# EAGLE design TempSensorMunny (EAGLE 5.04)
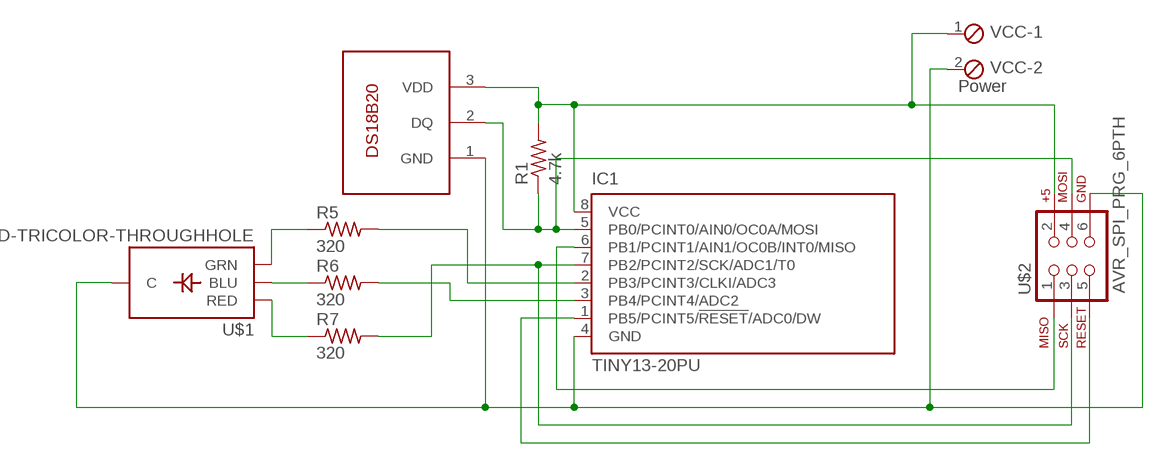
[diagram p0: schematic, sheet 1]

## Parts
IC1  TINY13-20PU  [DIL08]
R1  4.7k  R-US_0411/3V  [0411V]
R5  320  R-US_0411/3V  [0411V]
R6  320  R-US_0411/3V  [0411V]
R7  320  R-US_0411/3V  [0411V]
U$1  LED-TRICOLOR-THROUGHHOLE  [LED-TRICOLOR-THROUGHHOLE]
U$2  AVR_SPI_PRG_6PTH  [2X3]
U$3  DS18B20  [TO-92]
VCC  Power  MPT2  [2POL254]

## Nets
GND: IC1.4(GND) U$1.GND(C) U$2.6 U$3.1(GND) VCC.2
N$1: R5.1 U$1.GRN
N$2: R6.1 U$1.BLU
N$3: R7.1 U$1.RED
N$4: IC1.7(PB2/PCINT2/SCK/ADC1/T0) R7.2 U$2.3
N$5: IC1.3(PB4/PCINT4/ADC2) R6.2
N$6: IC1.2(PB3/PCINT3/CLKI/ADC3) R5.2
N$9: IC1.5(PB0/PCINT0/AIN0/OC0A/MOSI) R1.1 U$2.4 U$3.2(DQ)
N$10: IC1.6(PB1/PCINT1/AIN1/OC0B/INT0/MISO) U$2.1
N$11: IC1.1(PB5/PCINT5/!RESET!/ADC0/DW) U$2.5
VDD: IC1.8(VCC) R1.2 U$2.2 U$3.3(VDD) VCC.1

## Library data of the parts
IC1 = atmel:TINY13: 8-bit AVR Microcontroller with 1K Bytes In-System Programmable Flash Source: http://www.atmel.com/dyn/resources/prod_documents/2535S.pdf
R1 R5-R7 = resistor:R-US_: RESISTOR, American symbol
U$1 = SparkFun:LED-TRICOLOR-THROUGHHOLE
U$2 = SparkFun:AVR_SPI_PRG_6: AVR ISP 6 Pin This is the reduced ISP connector for AVR programming. Common on Arduino. This footprint will take up less PCB space and can be used with a 10-pin to 6-pin adapter such as SKU: BOB-08508
U$3 = nall:DS18B20: DS18B20 1-Wire digital temperature sensor from Maxim IC. Reports degrees C with 9 to 12-bit precision, -55C to 125C (+/-0.5C).
VCC = con-phoenix-254:MPT2: PHOENIX CONNECTOR

## Board
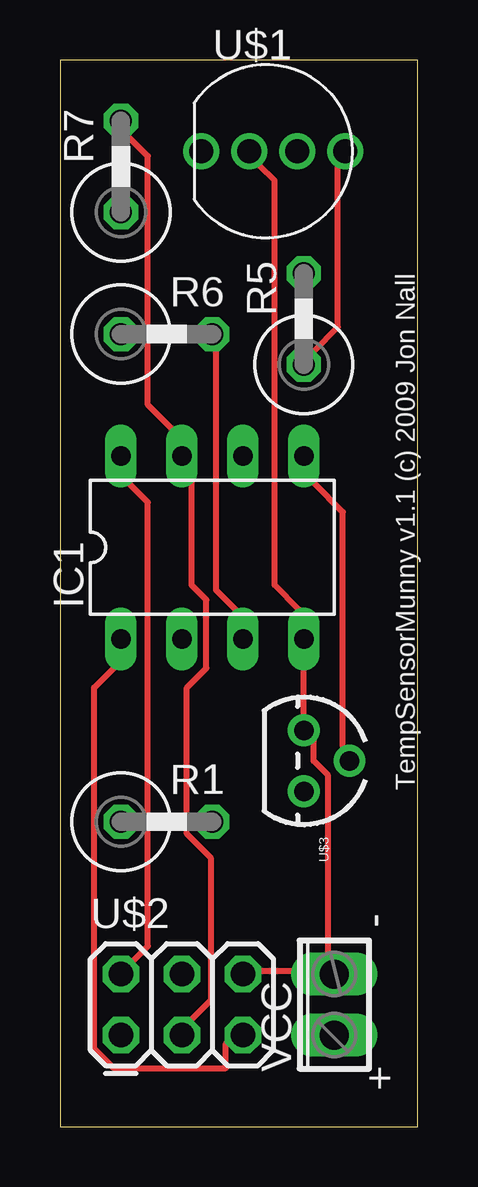
[diagram p1: board, top side]
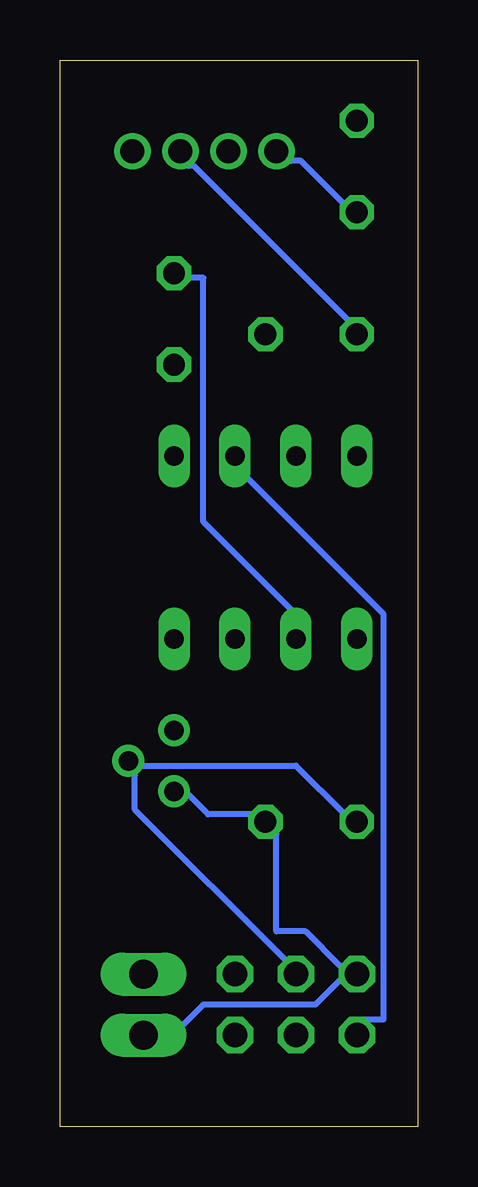
[diagram p2: board, bottom side, seen from below]

Size 14.91 x 44.44 mm. Coordinates in mm from the lower left corner, seen from the top.
Outline: 0,0 14.91,0 14.91,44.44 0,44.44 0,0
Copper layers (1*16): Top 0.035mm / dielectric 1.5mm / Bottom 0.035mm
Design rules "default": minimum track width 10mil, minimum drill 24mil, track to track 8mil, track to pad 8mil, pad to pad 8mil, via to via 8mil, smd to smd 8mil, copper to edge 40mil, drill to drill 8mil, minimum pad ring 10mil, minimum via ring 8mil, stop-mask expansion 4mil, vias tented up to drill 0mil, thermal gap 10mil

### Footprints (pad centres in the part's own frame; a part is rotated, then mirrored left to right if it is on the bottom)
DIL08 = drill 0.813 long: 1 -3.81,-3.81; 2 -1.27,-3.81; 3 1.27,-3.81; 4 3.81,-3.81; 5 3.81,3.81; 6 1.27,3.81; 7 -1.27,3.81; 8 -3.81,3.81
0411V = drill 0.914 octagon: 1 -2.54,0; 2 1.27,0
LED-TRICOLOR-THROUGHHOLE = drill 1 round: BLU 1,0; GND -1,0; GRN 3,0; RED -3,0
2X3 = drill 1.016 octagon: 1 0,0; 2 0,2.54; 3 2.54,0; 4 2.54,2.54; 5 5.08,0; 6 5.08,2.54
TO-92 = drill 0.813 round: 1 -1.27,0; 2 0,1.905; 3 1.27,0
2POL254 = drill 1.2 long: 1 -1.27,0; 2 1.27,0

### Placement (x,y rotation side)
IC1  6.35,24.13 0 top
R1  5.08,12.7 0 top
R5  10.16,34.29 90 top
R6  5.08,33.02 0 top
R7  2.54,40.64 90 top
U$1  8.89,40.64 0 top
U$2  2.54,3.81 0 top
U$3  10.16,15.24 270 top
VCC  11.43,5.08 90 top

### Tracks (layer width: path | path; a pad name or v marks a point on that pad's centre or on a via)
GND
  Top 0.254: U$2.6 8.33,6.5 9.75,6.5 VCC.2 11.18,7.11 11.18,14.63 10.57,15.24 10.57,16.05 U$3.1 IC1.4 9.96,21.54 8.94,22.55 8.94,39.42 8.33,40.03 U$1.GND
N$1
  Top 0.254: R5.1 10.57,32.31 11.58,33.33 11.58,40.03 U$1.GRN
N$2
  Bottom 0.254: R6.1 2.85,33.53 9.35,40.03 9.55,40.03 U$1.BLU
N$3
  Bottom 0.254: R7.1 3.05,38.41 4.88,40.23 5.28,40.23 U$1.RED
N$4
  Top 0.254: R7.2 2.85,41.25 3.66,40.44 3.66,30.07 4.67,29.06 IC1.7 5.49,26.82 5.49,22.55 6.1,21.95 6.1,19.1 5.28,18.29 5.28,12.19 6.3,11.18 6.3,5.28 5.49,4.47 U$2.3
N$5
  Top 0.254: IC1.3 7.32,21.54 6.5,22.35 6.5,32.51 R6.2
N$6
  Bottom 0.254: IC1.2 5.28,21.54 8.94,25.2 8.94,35.36 9.55,35.36 R5.2
N$9
  Top 0.254: IC1.5 10.57,26.82 11.79,25.6 11.79,15.85 U$3.2
  Bottom 0.254: R1.1 3.05,13.01 5.08,15.04 11.58,15.04 U$3.2 11.79,14.63 11.79,13.21 5.49,6.91 U$2.4
N$10
  Bottom 0.254: IC1.6 7.11,27.03 1.42,21.34 1.42,4.47 2.23,4.47 U$2.1
N$11
  Top 0.254: IC1.1 2.23,19.1 1.42,18.29 1.42,3.25 2.23,2.44 6.91,2.44 6.91,3.45 U$2.5
VDD
  Top 0.254: IC1.8 2.85,26.82 3.66,26.01 3.66,7.52 3.05,6.91 U$2.2
  Bottom 0.254: U$3.3 9.55,13.82 8.74,13.01 6.91,13.01 R1.2 5.89,12.19 5.89,8.13 4.67,8.13 3.25,6.71 U$2.2 3.25,6.1 4.27,5.08 8.94,5.08 9.75,4.27 VCC.1

### Text on the board
tPlace: TempSensorMunny v1.1 (c) 2009 Jon Nall | - | +